# Altium schematic sheet MohamedAazir_WirelessEMG__version_1.0_PCB__Filters.schdoc
size 285 x 193 mm
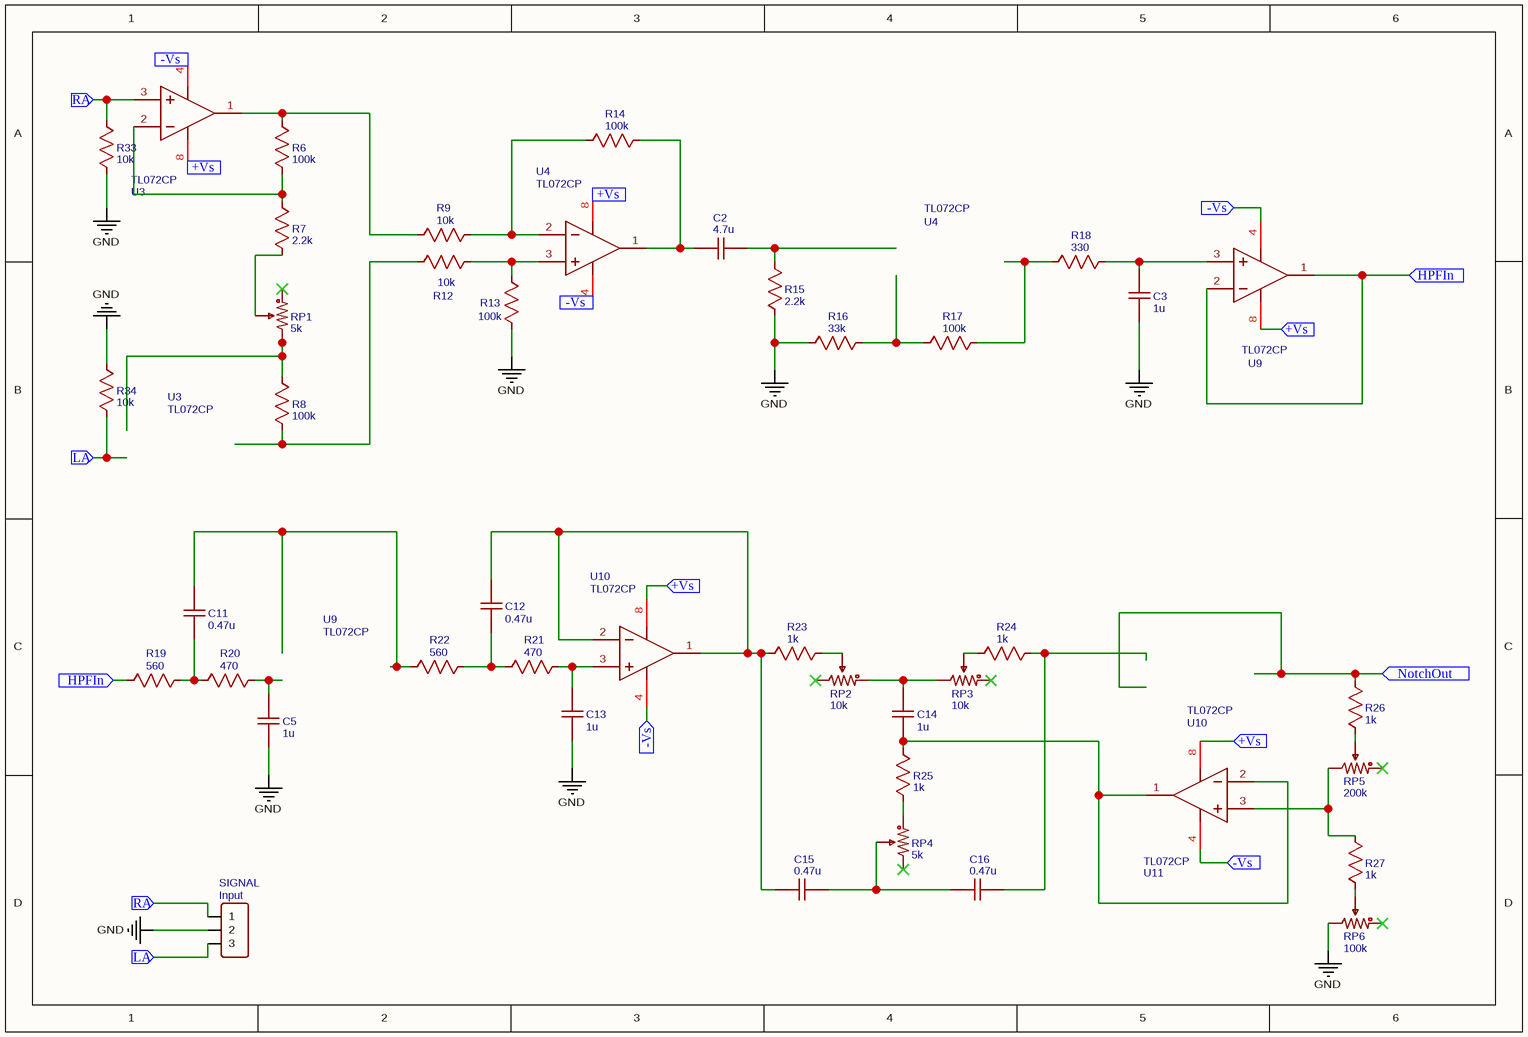
[diagram p0: MohamedAazir_WirelessEMG__version_1.0_PCB__Filters.schdoc]

## Parts
(Parts that share a designator on the sheet are numbered #1, #2 ... from top to bottom, then left to right.)
C2  4.7u  [C0603]
C3  1u  [C0603]
C5  1u  [C0603]
C11  0.47u  [C0603]
C12  0.47u  [C0603]
C13  1u  [C0603]
C14  1u  [C0603]
C15  0.47u  [C0603]
C16  0.47u  [C0603]
R6  100k  [R0603]
R7  2.2k  [R0603]
R8  100k  [R0603]
R9  10k  [R0603]
R12  10k  [R0603]
R13  100k  [R0603]
R14  100k  [R0603]
R15  2.2k  [R0603]
R16  33k  [R0603]
R17  100k  [R0603]
R18  330  [R0603]
R19  560  [R0603]
R20  470  [R0603]
R21  470  [R0603]
R22  560  [R0603]
R23  1k  [R0603]
R24  1k  [R0603]
R25  1k  [R0603]
R26  1k  [R0603]
R27  1k  [R0603]
R33  10k  [R0603]
R34  10k  [R0603]
RP1  5k  [RES-ADJ-TH_3386P]
RP2  10k  [RES-ADJ-TH_3386P]
RP3  10k  [RES-ADJ-TH_3386P]
RP4  5k  [RES-ADJ-TH_3386P]
RP5  200k  [RES-ADJ-TH_3386P]
RP6  100k  [RES-ADJ-TH_3386P]
SIGNAL  Input  [HDR-TH_3P-P2.54-V-F]
U3#1  TL072CP  [DIP-8_L9.6-W6.4-P2.54-LS7.6-BL-1]
U3#2  TL072CP  [DIP-8_L9.6-W6.4-P2.54-LS7.6-BL-1]
U4#1  TL072CP  [DIP-8_L9.6-W6.4-P2.54-LS7.6-BL-1]
U4#2  TL072CP  [DIP-8_L9.6-W6.4-P2.54-LS7.6-BL-1]
U9#1  TL072CP  [DIP-8_L9.6-W6.4-P2.54-LS7.6-BL-1]
U9#2  TL072CP  [DIP-8_L9.6-W6.4-P2.54-LS7.6-BL-1]
U10#1  TL072CP  [DIP-8_L9.6-W6.4-P2.54-LS7.6-BL-1]
U10#2  TL072CP  [DIP-8_L9.6-W6.4-P2.54-LS7.6-BL-1]
U11  TL072CP  [DIP-8_L9.6-W6.4-P2.54-LS7.6-BL-1]

## Ports
+Vs (in), -Vs (in), HPFIn (in), LA (in), NotchOut (in), RA (in)

## Nets
GND: C3.1 C5.2 C13.2 R13.1 R15.1 R16.2 R33.1 R34.2 RP6.3 SIGNAL.2
+Vs: U3#1.8(VCC+) U4#1.8(VCC+) U9#1.8(VCC+) U10#1.8(VCC+) U11.8(VCC+) ; port +Vs
-Vs: U3#1.4(VCC-) U4#1.4(VCC-) U9#1.4(VCC-) U10#1.4(VCC-) U11.4(VCC-) ; port -Vs
HPFIn: R19.1 U9#1.1(OUT1) U9#1.2(IN1-) ; port HPFIn
LA: R34.1 SIGNAL.3 ; port LA
NotchOut: R26.2 ; port NotchOut
RA: R33.2 SIGNAL.1 U3#1.3(IN1+) ; port RA
NetC2_1: C2.1 R14.1 U4#1.1(OUT1)
NetC2_2: C2.2 R15.2
NetC3_2: C3.2 R18.1 U9#1.3(IN1+)
NetC5_1: C5.1 R20.2
NetC11_1: C11.1 R22.1
NetC11_2: C11.2 R19.2 R20.1
NetC12_1: C12.1 C15.2 R23.1 U10#1.1(OUT1) U10#1.2(IN1-)
NetC12_2: C12.2 R21.1 R22.2
NetC13_1: C13.1 R21.2 U10#1.3(IN1+)
NetC14_1: C14.1 R25.2 U11.1(OUT1) U11.2(IN1-)
NetC14_2: C14.2 RP2.1 RP3.3
NetC15_1: C15.1 C16.2 RP4.2
NetC16_1: C16.1 R24.2
NetR6_1: R6.1 R7.2 U3#1.2(IN1-)
NetR6_2: R6.2 R9.1 U3#1.1(OUT1)
NetR7_1: R7.1 RP1.2
NetR8_1: R8.1 R12.1
NetR8_2: R8.2 RP1.3
NetR9_2: R9.2 R14.2 U4#1.2(IN1-)
NetR12_2: R12.2 R13.2 U4#1.3(IN1+)
NetR16_1: R16.1 R17.2
NetR17_1: R17.1 R18.2
NetR23_2: R23.2 RP2.2
NetR24_1: R24.1 RP3.2
NetR25_1: R25.1 RP4.1
NetR26_1: R26.1 RP5.2
NetR27_1: R27.1 RP6.2
NetR27_2: R27.2 RP5.3 U11.3(IN1+)

Not connected (* = marked no-connect by the designer): RP1 1*; RP2 3*; RP3 1*; RP4 3*; RP5 1*; RP6 1*

## Library data of the parts
C2 = 4.7u: Manufacturer Part: CA45B-A-25V-4.7UF-K; Manufacturer: CEC(振华新云); nameAlias: Value(F); Contributor: LCEDA_Lib; Supplier Part: C2976925; Supplier: LCSC; spicePre: C; spiceSymbolName: C_0603_US
C3 C5 C13 C14 = 1u: Manufacturer Part: T491B105M035AT; Manufacturer: KEMET(基美); nameAlias: Value(F); Contributor: LCEDA_Lib; Supplier Part: C600504; Supplier: LCSC; spicePre: C; spiceSymbolName: C_0603_US
C11 C12 C15 C16 = 0.47u: Manufacturer Part: CA45-A-35V-0.47UF-K; Manufacturer: CEC(振华新云); nameAlias: Value(F); Contributor: LCEDA_Lib; Supplier Part: C1021641; Supplier: LCSC; spicePre: C; spiceSymbolName: C_0603_US
R6 R8 R13 R14 R17 = 100k: Manufacturer Part: SM204F100KTKQTR3K0; Manufacturer: Firstohm(第一电阻); nameAlias: Value(Ω); Contributor: LCEDA_Lib; Supplier Part: C915957; Supplier: LCSC; spicePre: R; spiceSymbolName: R_0603_US
R7 R15 = 2.2k: Manufacturer Part: MMB02070C2201FB200; Manufacturer: VISHAY(威世); nameAlias: Value(Ω); Contributor: LCEDA_Lib; Supplier Part: C2979786; Supplier: LCSC; spicePre: R; spiceSymbolName: R_0603_US
R9 R12 R33 R34 = 10k: Manufacturer Part: CSR0204FTDV1002; Manufacturer: Viking(光颉); nameAlias: Value(Ω); Contributor: LCEDA_Lib; Supplier Part: C316475; Supplier: LCSC; spicePre: R; spiceSymbolName: R_0603_US
R16 = 33k: Manufacturer Part: MEV07V3302FE; Manufacturer: Ohmite; nameAlias: Value(Ω); Contributor: LCEDA_Lib; Supplier Part: C4216305; Supplier: LCSC; spicePre: R; spiceSymbolName: R_0603_US
R18 = 330: Manufacturer Part: MM52F330RTKRTR2K0; Manufacturer: Firstohm(第一电阻); nameAlias: Value(Ω); Contributor: LCEDA_Lib; Supplier Part: C232498; Supplier: LCSC; spicePre: R; spiceSymbolName: R_0603_US
R19 R22 = 560: Manufacturer Part: 2D02WGJ0561TCE; Manufacturer: UNI-ROYAL(厚声); nameAlias: Value(Ω); Contributor: LCEDA_Lib; Supplier Part: C425325; Supplier: LCSC; spicePre: R; spiceSymbolName: R_0603_US
R20 R21 = 470: Manufacturer Part: LMERW250F470RQ9L; Manufacturer: RESI(开步睿思); nameAlias: Value(Ω); Contributor: LCEDA_Lib; Supplier Part: C719994; Supplier: LCSC; spicePre: R; spiceSymbolName: R_0603_US
R23-R27 = 1k: Manufacturer Part: RJM74P0204F2T1001; Manufacturer: Tyohm(幸亚电阻); nameAlias: Value(Ω); Contributor: LCEDA_Lib; Supplier Part: C410704; Supplier: LCSC; spicePre: R; spiceSymbolName: R_0603_US
RP1 RP4 = 5k: Manufacturer Part: VG039NCHXTB502; Manufacturer: HDK(北陆电气); nameAlias: Value; Contributor: LCEDA_Lib; value(Ω): 10K; Supplier Part: C128557; Supplier: LCSC; spicePre: R; spiceSymbolName: R_3386P_US
RP2 RP3 = 10k: Manufacturer Part: ST-4ETG 10K OHM (103); Manufacturer: NIDEC(尼得科); nameAlias: Value; Contributor: LCEDA_Lib; Supplier Part: C132882; Supplier: LCSC; value(Ω): 10K; spicePre: R; spiceSymbolName: R_3386P_US
RP5 = 200k: Manufacturer Part: ST-32EA 200K ohm (204); Manufacturer: NIDEC(尼得科); nameAlias: Value; Contributor: LCEDA_Lib; value(Ω): 10K; Supplier Part: C132895; Supplier: LCSC; spicePre: R; spiceSymbolName: R_3386P_US
RP6 = 100k: Manufacturer Part: CT-6EH 100Kohm(104); Manufacturer: NIDEC(尼得科); nameAlias: Value; Contributor: LCEDA_Lib; value(Ω): 10K; Supplier Part: C132924; Supplier: LCSC; spicePre: R; spiceSymbolName: R_3386P_US
SIGNAL = Input: Manufacturer: BOOMELE(博穆精密); Manufacturer Part: 2.54-1*3P母; Supplier Part: C146243; Supplier: LCSC; JLCPCB Part Class: Extended Part; spicePre: P; spiceSymbolName: Header-Female-2.54_1x3
U3#1 U3#2 U4#1 U4#2 U9#1 U9#2 U10#1 U10#2 U11 = TL072CP: subpart_no: 1; Manufacturer: TI(德州仪器); tags: FET Operational Amplifier; Supplier Part: C7236; Supplier: LCSC; Manufacturer Part: TL072CP; JLCPCB Part Class: Extended Part; spicePre: U; spiceSymbolName: TL072CP